# Altium schematic sheet 0_Top.SchDoc
size A4; DocumentNumber: 1; SheetNumber: 1; SheetTotal: 5
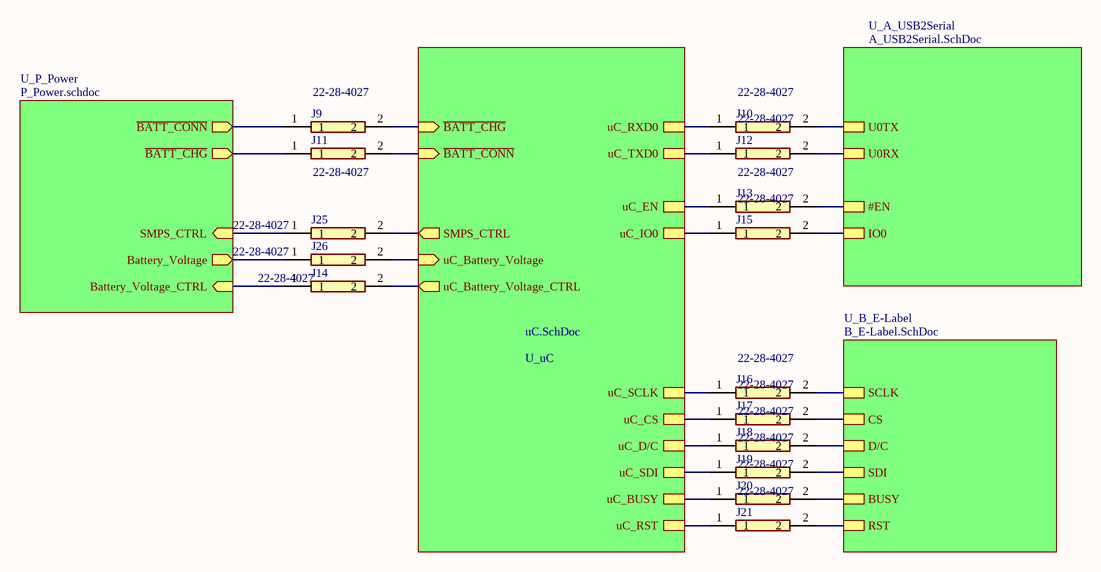
[diagram p0: 0_Top.SchDoc]

## Parts
J9  22-28-4027  [HDRV2W66P0X254_1X2_508X249X1067P]
J10  22-28-4027  [HDRV2W66P0X254_1X2_508X249X1067P]
J11  22-28-4027  [HDRV2W66P0X254_1X2_508X249X1067P]
J12  22-28-4027  [HDRV2W66P0X254_1X2_508X249X1067P]
J13  22-28-4027  [HDRV2W66P0X254_1X2_508X249X1067P]
J14  22-28-4027  [HDRV2W66P0X254_1X2_508X249X1067P]
J15  22-28-4027  [HDRV2W66P0X254_1X2_508X249X1067P]
J16  22-28-4027  [HDRV2W66P0X254_1X2_508X249X1067P]
J17  22-28-4027  [HDRV2W66P0X254_1X2_508X249X1067P]
J18  22-28-4027  [HDRV2W66P0X254_1X2_508X249X1067P]
J19  22-28-4027  [HDRV2W66P0X254_1X2_508X249X1067P]
J20  22-28-4027  [HDRV2W66P0X254_1X2_508X249X1067P]
J21  22-28-4027  [HDRV2W66P0X254_1X2_508X249X1067P]
J25  22-28-4027  [HDRV2W66P0X254_1X2_508X249X1067P]
J26  22-28-4027  [HDRV2W66P0X254_1X2_508X249X1067P]

## Sub-sheets
U_A_USB2Serial = A_USB2Serial.SchDoc: U0TX, U0RX, #EN, IO0
U_B_E-Label = B_E-Label.SchDoc: SCLK, CS, D/C, SDI, BUSY, RST
U_P_Power = P_Power.schdoc: SMPS_CTRL (in), ~{BATT_CONN} (out), ~{BATT_CHG} (out), Battery_Voltage (out), Battery_Voltage_CTRL (in)
U_uC = uC.SchDoc: uC_TXD0, uC_RXD0, uC_EN, uC_IO0, uC_SDI, uC_CS, uC_D/C, uC_SCLK, uC_BUSY, uC_RST, ~{BATT_CHG} (in), ~{BATT_CONN} (in), SMPS_CTRL (out), uC_Battery_Voltage_CTRL (out), uC_Battery_Voltage (in)

## Nets
NetJ9_1: J9.1 ; sheet U_P_Power/~{BATT_CONN}
NetJ9_2: J9.2 ; sheet U_uC/~{BATT_CHG}
NetJ10_1: J10.1 ; sheet U_uC/uC_RXD0
NetJ10_2: J10.2 ; sheet U_A_USB2Serial/U0TX
NetJ11_1: J11.1 ; sheet U_P_Power/~{BATT_CHG}
NetJ11_2: J11.2 ; sheet U_uC/~{BATT_CONN}
NetJ12_1: J12.1 ; sheet U_uC/uC_TXD0
NetJ12_2: J12.2 ; sheet U_A_USB2Serial/U0RX
NetJ13_1: J13.1 ; sheet U_uC/uC_EN
NetJ13_2: J13.2 ; sheet U_A_USB2Serial/#EN
NetJ14_1: J14.1 ; sheet U_P_Power/Battery_Voltage_CTRL
NetJ14_2: J14.2 ; sheet U_uC/uC_Battery_Voltage_CTRL
NetJ15_1: J15.1 ; sheet U_uC/uC_IO0
NetJ15_2: J15.2 ; sheet U_A_USB2Serial/IO0
NetJ16_1: J16.1 ; sheet U_uC/uC_SCLK
NetJ16_2: J16.2 ; sheet U_B_E-Label/SCLK
NetJ17_1: J17.1 ; sheet U_uC/uC_CS
NetJ17_2: J17.2 ; sheet U_B_E-Label/CS
NetJ18_1: J18.1 ; sheet U_uC/uC_D/C
NetJ18_2: J18.2 ; sheet U_B_E-Label/D/C
NetJ19_1: J19.1 ; sheet U_uC/uC_SDI
NetJ19_2: J19.2 ; sheet U_B_E-Label/SDI
NetJ20_1: J20.1 ; sheet U_uC/uC_BUSY
NetJ20_2: J20.2 ; sheet U_B_E-Label/BUSY
NetJ21_1: J21.1 ; sheet U_uC/uC_RST
NetJ21_2: J21.2 ; sheet U_B_E-Label/RST
NetJ25_1: J25.1 ; sheet U_P_Power/SMPS_CTRL
NetJ25_2: J25.2 ; sheet U_uC/SMPS_CTRL
NetJ26_1: J26.1 ; sheet U_P_Power/Battery_Voltage
NetJ26_2: J26.2 ; sheet U_uC/uC_Battery_Voltage

## Library data of the parts
J9-J21 J25 J26 = 22-28-4027: Connector; Manufacturer_Name: Molex; Datasheet Link: https://componentsearchengine.com//22-28-4027.pdf; Height: 10.67mm; Mouser2 Part Number: 538-22-28-4027; Mouser2 Price/Stock: https://www.mouser.com/Search/Refine.aspx?Keyword=538-22-28-4027; Manufacturer_Part_Number: 22-28-4027